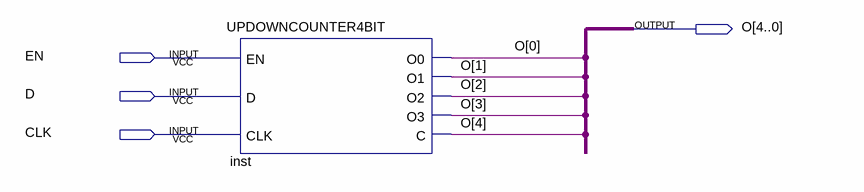
[diagram p0: schematic sheet]
// Quartus schematic UPDOWNCOUNTER4BITV2.bdf as structural Verilog: 1 symbols, 4 pins
module UPDOWNCOUNTER4BITV2 (
  input  EN,
  input  D,
  input  CLK,
  output [4:0] O
);

  UPDOWNCOUNTER4BIT inst (.EN(EN), .D(D), .CLK(CLK), .O0(O[0]), .O1(O[1]), .O2(O[2]), .O3(O[3]), .C(O[4]));
endmodule
